# EAGLE design MINI_SAM_TQFP_1.27_SIMPLE_2016_12_12_001 (EAGLE 7.6.0)
DESIGNER: BENJAMIN SHOCKLEY; REV: A
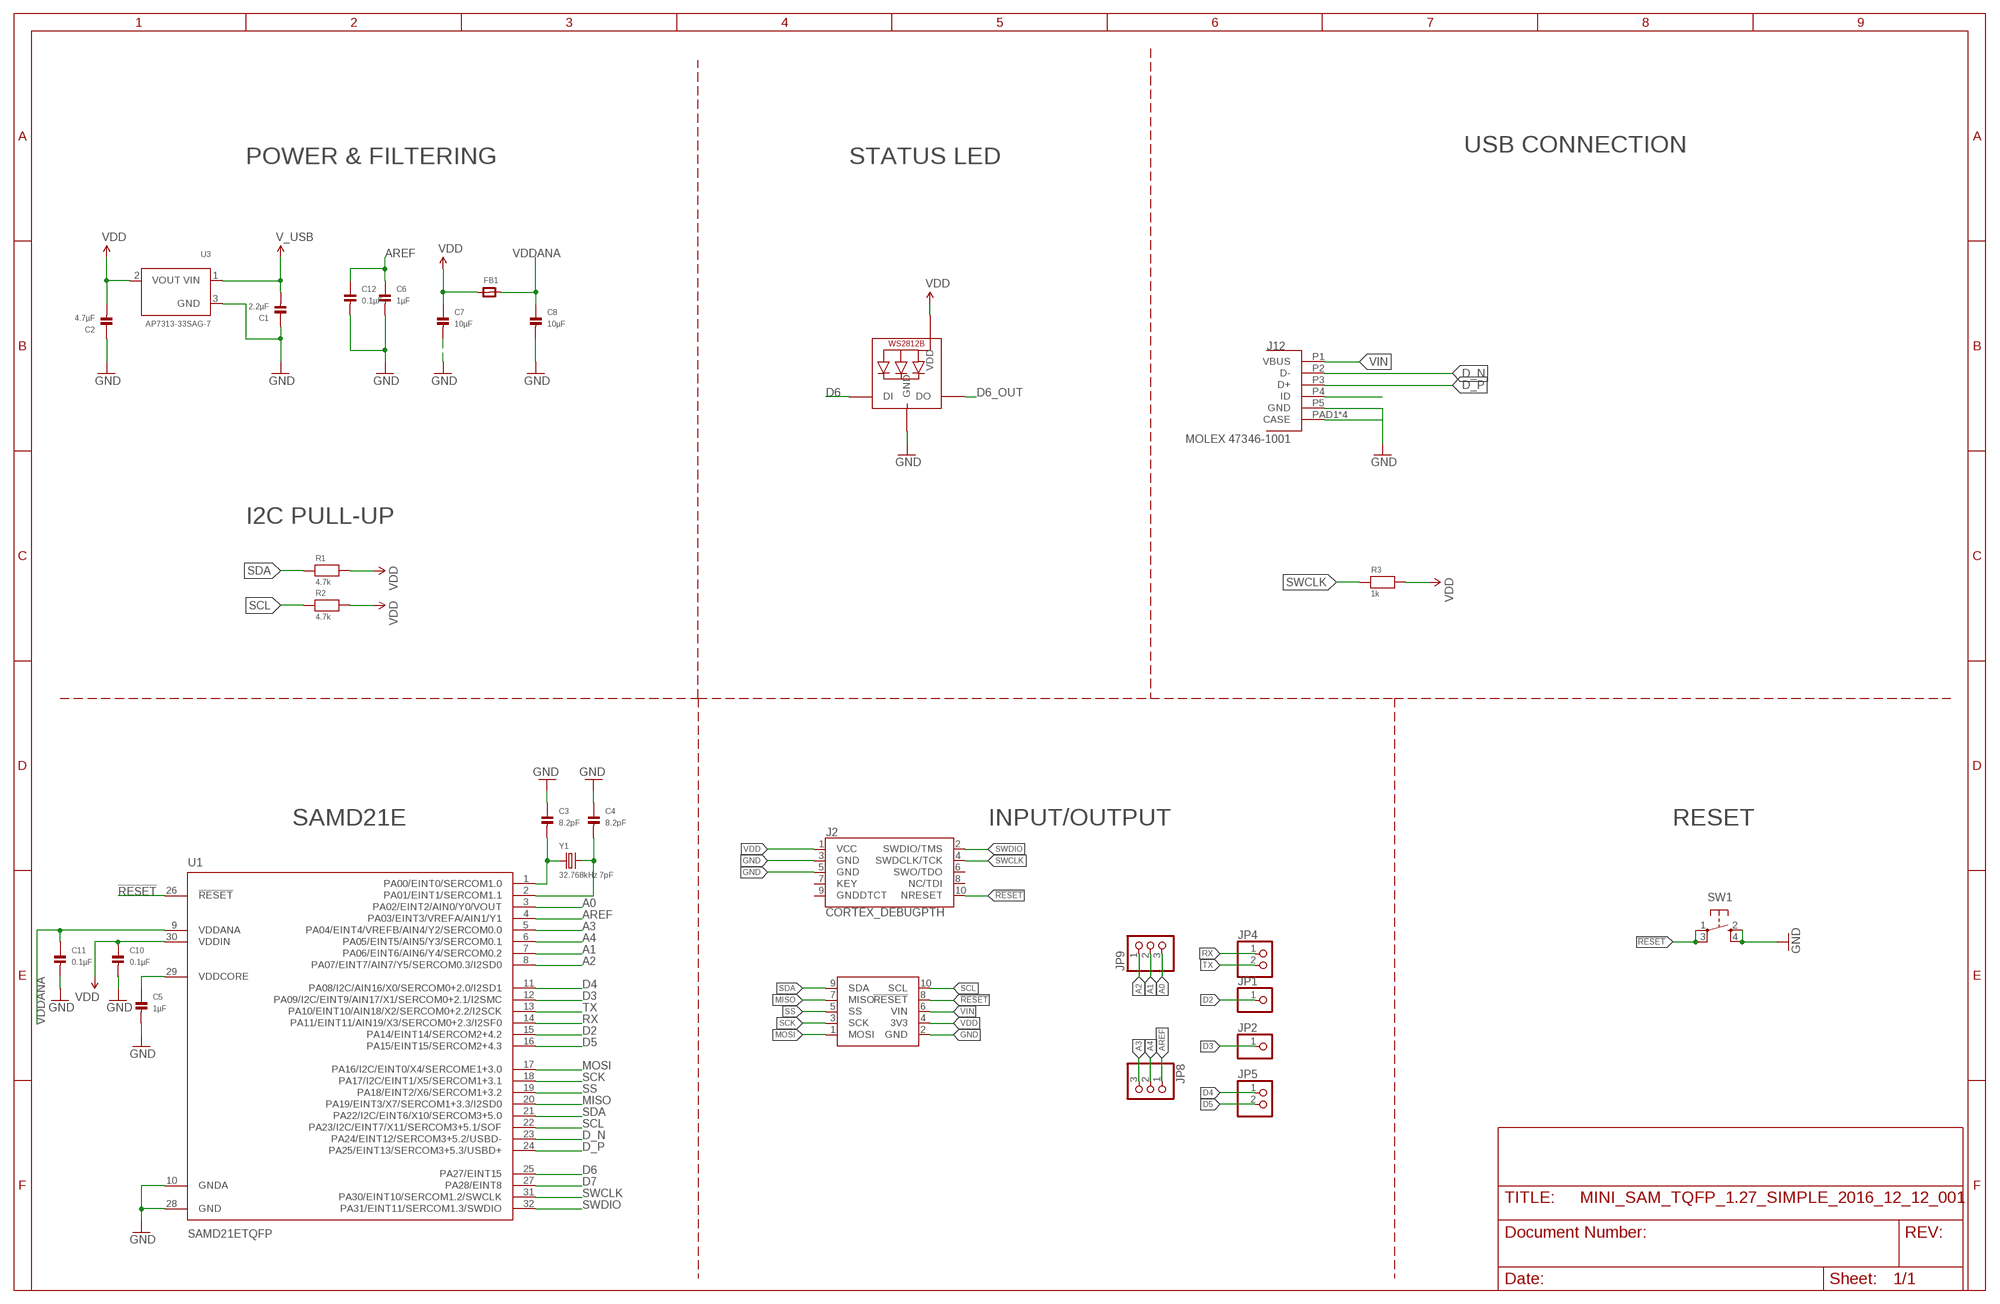
[diagram p0: schematic, sheet 1]

## Parts
C1  2.2µF  CAP_CERAMIC_0805MP  [_0805MP]
C2  4.7µF  CAP_CERAMIC_0805MP  [_0805MP]
C3  8.2pF  CAP_CERAMIC_0805MP  [_0805MP]
C4  8.2pF  CAP_CERAMIC_0805MP  [_0805MP]
C5  1µF  CAP_CERAMIC_0805MP  [_0805MP]
C6  1µF  CAP_CERAMIC_0805MP  [_0805MP]
C7  10µF  CAP_CERAMIC_0805MP  [_0805MP]
C8  10µF  CAP_CERAMIC_0805MP  [_0805MP]
C10  0.1µF  CAP_CERAMIC_0805MP  [_0805MP]
C11  0.1µF  CAP_CERAMIC_0805MP  [_0805MP]
C12  0.1µF  CAP_CERAMIC_0805MP  [_0805MP]
FB1  FERRITE_0805MP  [_0805MP]
J2  CORTEX_DEBUGPTH  [2X5-PTH-1.27MM]
J12  MOLEX_47346-100147346  [MOLEX_47346-1001]
JP1  HEADER-1X1ROUND  [1X01_ROUND]
JP2  HEADER-1X1ROUND  [1X01_ROUND]
JP4  HEADER-1X2ROUND  [1X02_ROUND]
JP5  HEADER-1X2ROUND  [1X02_ROUND]
JP8  HEADER-1X3ROUND  [1X03_ROUND]
JP9  HEADER-1X3ROUND  [1X03_ROUND]
R1  4.7k  RESISTOR_0805MP  [_0805MP]
R2  4.7k  RESISTOR_0805MP  [_0805MP]
R3  1k  RESISTOR_0805MP  [_0805MP]
STATUS  WS2812B3535  [LED3535]
SW1  SPST_TACT-KMR2  [KMR2]
U1  SAMD21ETQFP  [TQFP32-08]
U3  AP7313-33SAG-7  VREG_SOT23  [SOT23-R]
U$3  MINI_SAM_10_PIN  [M50-360XXXX]
Y1  32.768kHz 7pF  CRYSTAL0805PACKAGE  [_0805MP]

## Nets
!RESET: J2.10(NRESET) SW1.1(P) SW1.3(P1) U1.26(!RESET) U$3.8(!RESET)
A0: JP9.3 U1.3(PA02/EINT2/AIN0/Y0/VOUT)
A1: JP9.2 U1.7(PA06/EINT6/AIN6/Y4/SERCOM0.2)
A2: JP9.1 U1.8(PA07/EINT7/AIN7/Y5/SERCOM0.3/I2SD0)
A3: JP8.3 U1.5(PA04/EINT4/VREFB/AIN4/Y2/SERCOM0.0)
A4: JP8.2 U1.6(PA05/EINT5/AIN5/Y3/SERCOM0.1)
AREF: C6.1 C12.1 JP8.1 U1.4(PA03/EINT3/VREFA/AIN1/Y1)
D2: JP1.1 U1.15(PA14/EINT14/SERCOM2+4.2)
D3: JP2.1 U1.12(PA09/I2C/EINT9/AIN17/X1/SERCOM0+2.1/I2SMC)
D4: JP5.1 U1.11(PA08/I2C/AIN16/X0/SERCOM0+2.0/I2SD1)
D5: JP5.2 U1.16(PA15/EINT15/SERCOM2+4.3)
D6: STATUS.1(DI) U1.25(PA27/EINT15)
D6_OUT: STATUS.3(DO)
D7: U1.27(PA28/EINT8)
D_N [USB_DATA]: J12.P2(D-) U1.23(PA24/EINT12/SERCOM3+5.2/USBD-)
D_P [USB_DATA]: J12.P3(D+) U1.24(PA25/EINT13/SERCOM3+5.3/USBD+)
GND: C1.1 C2.1 C3.1 C4.1 C5.2 C6.2 C7.2 C8.2 C10.2 C11.2 C12.2 J2.3(GND) J2.5(GND) J12.P5(GND) J12.PAD1(CASE) J12.PAD2(CASE) J12.PAD3(CASE) J12.PAD4(CASE) STATUS.4(GND) SW1.2(S) SW1.4(S1) U1.10(GNDA) U1.28(GND) U3.3(GND) U$3.2(GND)
MISO: U1.20(PA19/EINT3/X7/SERCOM1+3.3/I2SD0) U$3.7(MISO)
MOSI: U1.17(PA16/I2C/EINT0/X4/SERCOME1+3.0) U$3.1(MOSI)
N$1: C3.2 U1.1(PA00/EINT0/SERCOM1.0) Y1.1
N$5: C4.2 U1.2(PA01/EINT1/SERCOM1.1) Y1.2
N$9: C5.1 U1.29(VDDCORE)
N$10: J12.P4(ID)
RX: JP4.1 U1.14(PA11/EINT11/AIN19/X3/SERCOM0+2.3/I2SF0)
SCK: U1.18(PA17/I2C/EINT1/X5/SERCOM1+3.1) U$3.3(SCK)
SCL: R2.1 U1.22(PA23/I2C/EINT7/X11/SERCOM3+5.1/SOF) U$3.10(SCL)
SDA: R1.1 U1.21(PA22/I2C/EINT6/X10/SERCOM3+5.0) U$3.9(SDA)
SS: U1.19(PA18/EINT2/X6/SERCOM1+3.2) U$3.5(SS)
SWCLK: J2.4(SWDCLK/TCK) R3.1 U1.31(PA30/EINT10/SERCOM1.2/SWCLK)
SWDIO: J2.2(SWDIO/TMS) U1.32(PA31/EINT11/SERCOM1.3/SWDIO)
TX: JP4.2 U1.13(PA10/EINT10/AIN18/X2/SERCOM0+2.2/I2SCK)
VDD: C2.2 C7.1 C10.1 FB1.1 J2.1(VCC) R1.2 R2.2 R3.2 STATUS.2(VDD) U1.30(VDDIN) U3.2(VOUT) U$3.4(3V3)
VDDANA: C8.1 C11.1 FB1.2 U1.9(VDDANA)
VIN: C1.2 J12.P1(VBUS) U3.1(VIN) U$3.6(VIN) ; supply symbol labelled V_USB
Unconnected: J2.6(SWO/TDO) J2.7(KEY) J2.8(NC/TDI) J2.9(GNDDTCT)

## Notes on the sheet
- USB CONNECTION
- POWER & FILTERING | STATUS LED
- MOLEX 47346-1001
- I2C PULL-UP
- SAMD21E | INPUT/OUTPUT | RESET

## Library data of the parts
C1-C8 C10-C12 = microbuilder:CAP_CERAMIC: Ceramic Capacitors 0402 - 0402 Surface Mount Capacitors 16pF 50V 5% [Digikey: 445-4899-2-ND] 18pF 50V 5% [Digikey: 490-1281-2-ND] 22pF 50V 5% [Digikey: 490-1283-2-ND] 68pF 50V 5% [Digikey: 490-1289-2-ND] 0.1uF 10V 10% [Digikey: 490-1318-2-ND] 1.0uF 6.3V 10% [Digikey: 490-1320-2-ND] 0603 - 0603 Surface Mount Capacitors 16 pF 50V 5% [Digikey: 445-5051-2-ND] 22 pF 50V [Digikey: PCC220ACVTR-ND] 33 pF 50V 5% [Digikey: 490-1415-1-ND] 56pF 50V 5% [Digikey: 490-1421-1-ND] 220pF 50V 5% [Digikey: 445-1285-1-ND] 680 pF 50V 2200 pF 50V 5% C0G [Digikey: 445-1297-1-ND] 5600 pF 100V 5% X7R [Digikey: 478-3711-1-ND] 0.1 µF 25V 10% [Digikey: PCC2277TR-ND] 0.22 µF 16V 10% X7R [Digikey: 445-1318-1-ND] 1.0 µF 25V 10% [Digikey: 445-5146-2-ND] 0603 - RF Specific 3pF 250V +/-0.1pF RF [Digikey: 712-1347-1-ND] 18 pF 250V 5% [Digikey: 478-3505-1-ND or 712-1322-1-ND] 56 pF 250V 5% C0G RF [Digikey: 490-4867-1-ND] 68 pF 250V RF [Digikey: 490-4868-1-ND] 0805 - 0805 Surface Mount Capacitors 220 pF 250V 2% RF Ceramic Capacitor [Digikey: 712-1398-1-ND] 1000 pF 50V 2% NP0 Ceramic Capacitor [Digikey: 478-3760-1-ND] 0.1 µF 25V 10% Ceramic Capacitor [Digikey: PCC1828TR-ND] 1.0 µF 16V 10% Ceramic Capacitor[Digikey: 490-1691-2-ND] 10.0 µF 10V 10% Ceramic Capacitor[Digikey: 709-1228-1-ND] 10.0 uF 16V 10% Ceramic Capacitor [Digikey: 478-5165-2-ND] 47 uF 6.3V 20% Ceramic Capacitor [Digikey: 587-1779-1-ND or 399-5506-1-ND] 1206 - 1206 Surface Mount Capacitors 47uF 10V 20% Ceramic Capacitor [Digikey: 490-5528-1-ND or 399-5508-1-ND or 445-6010-1-ND] 100uF 6.3V -20%, +80% Y5V Ceramic Capacitor (Digikey: 490-4512-1-ND, Mouser: 81-GRM31CF50J107ZE1L)
FB1 = microbuilder:FERRITE: Ferrite Bead 0603 MMZ1608B121C - 120 Ohm @ 100MHz, 600mA, 0.15 Ohm DC Resistance - Digikey: 445-2164-1-ND BK1608HW121-T - 120 Ohm, 600mA Ferrite Chip - Digikey: 587-1876-2-ND 0805 HZ0805B272R-10 - 2.7K Ohm @ 100MHz, 200mA, 0.8 Ohm DC Resistance - Digikey: 240-2504-1-ND (see also Murata BLM21BD272SN1L) MMZ2012Y152B - 1.5K Ohm @ 100MHz, 500mA, 0.4 Ohm DC Resistance - Digikey: 445-1560-1-ND - Mainly for high frequency (80-400MHz) MMZ2012R102A - 1K Ohm @ 100MHz, 500mA, 0.3 Ohm DC Resistance - Digikey: 445-1555-2-ND - More general purpose (10-200MHz)
J2 = SparkFun-Connectors:CORTEX_DEBUG: Cortex Debug Connector Datasheet <http://infocenter.arm.com/help/topic/com.arm.doc.faqs/attached/13634/cortex_debug_connectors.pdf>
J12 = Shockley_Custom:MOLEX_47346-1001
JP1 JP2 = microbuilder:HEADER-1X1: PIN HEADER
JP4 JP5 = microbuilder:HEADER-1X2: PIN HEADER
JP8 JP9 = microbuilder:HEADER-1X3: PIN HEADER
R1-R3 = microbuilder:RESISTOR: Resistors 0402 - 0402 Surface Mount Package 22 Ohm 1% 1/16W [Digikey: 311-22.0LRTR-ND] 33 Ohm 5% 1/16W 1.0K 5% 1/16W 1.5K 5% 1/16W 2.0K 1% 1/16W 10.0K 1% 1/16W [Digikey: 311-10.0KLRTR-ND] 10.0K 5% 1/16W [Digikey: RMCF0402JT10K0TR-ND] 12.1K 1% 1/16W [Digikey: 311-22.0LRTR-ND] 100.0K 5% 1/16W 0603 - 0603 Surface Mount Package 0 Ohm 1/10 Watt 1% Resistor 15 Ohm 1/10 Watt 1% Resistor 33 Ohm 1/10 Watt 1% Resistor 49.9 Ohm 1/10 Watt 1% Resistor 100 Ohm 1/10 Watt 1% Resistor 150 Ohm 1/10 Watt 1% Resistor 240 Ohm 1/10 Watt 1% Resistor 390 Ohm 1/10 Watt 1% Resistor 560 Ohm 1/10 Watt 1% Resistor 680 Ohm 1/10 Watt 1% Resistor 750 Ohm 1/10 Watt 1% Resistor 1.0K Ohm 1/10 Watt 1% Resistor 1.5K Ohm 1/10 Watt 1% Resistor 2.0K Ohm 1/10 Watt 1% Resistor 2.2K Ohm 1/10 Watt 1% Resistor 3.3K Ohm 1/10 Watt 1% Resistor 4.7K Ohm 1/10 Watt 1% Resistor 10.0K Ohm 1/10 Watt 1% Resistor 12.0K Ohm 1/10 Watt 1% Resistor 12.1K Ohm 1/10 Watt 1% Resistor 20.0K Ohm 1/10 Watt 1% Resistor 33.0K Ohm 1/10 Watt 1% Resistor 100.0K Ohm 1/10 Watt 1% Resistor 0805 - 0805 Surface Mount Package 0 Ohm 1/8 Watt 1% Resistor 33 Ohm 1/8 Watt 1% Resistor 100 Ohm 1/8 Watt 1% Resistor 150 Ohm 1/8 Watt 1% Resistor 200 Ohm 1/8 Watt 1% Resistor 240 Ohm 1/8 Watt 1% Resistor 330 Ohm 1/8 Watt 1% Resistor 390 Ohm 1/8 Watt 1% Resistor 470 Ohm 1/8 Watt 1% Resistor 1.0K Ohm 1/8 Watt 1% Resistor 1.5K Ohm 1/8 Watt 1% Resistor 2.0K Ohm 1/8 Watt 1% Resistor 4.7K Ohm 1/8 Watt 1% Resistor 5.1K Ohm 1/8 Watt 1% Resistor 5.6K Ohm 1/8 Watt 1% Resistor 10.0K Ohm 1/8 Watt 1% Resistor 22.0K Ohm 1/8 Watt 1% Resistor 33.0K Ohm 1/8 Watt 1% Resistor 100K Ohm 1/8 Watt 1% Resistor 1206 - 1206 Surface Mount Package 2012 - 2010 Surface Mount Package 0.11 Ohm 1/2 Watt 1% Resistor - Digikey: RHM.11UCT-ND
STATUS = adafruit:WS2812B
SW1 = adafruit:SPST_TACT: SMT 6mm switch, EVQQ2 series http://www.ladyada.net/library/eagle
U1 = Shockley_Custom:SAMD21E
U3 = microbuilder:VREG_SOT23: SOT23 Fixed Voltage Regulators Part Current Out V Out V In V Dropout Digikey Part No. AP7313 150mA 3.3V 3.5-6V 0.15V @ 150mA AP7313-33SAG-7DICT-ND
U$3 = Shockley_Custom:MINI_SAM_10_PIN
Y1 = Shockley_Custom:CRYSTAL: Crystals HC49UP - Surface Mount Crystal 4.0MHz 18pF +/-30ppm Surface Mount Crystal [Digikey: 535-9857-1-ND] 12.0 MHz Surface Mount Crystal [Digikey: 535-9869-6-ND] 25.0 MHz Surface Mount Crystal [Digikey: 535-9078-1-ND] 2.5 x 2.0mm - MEMs SMT Crystal 16.0 MHz 10pF 20ppm 2.5 x 2.0mm Crystal [Digikey -40-85°C: 535-10923-1-ND] 3.2 x 2.5mm - MEMs SMT Crystal 12.0 MHz 8pF 15ppm 3.2 x 2.5mm Crystal [Digikey: -10-70°C: 644-1047-1-ND -40-125°C: 644-1128-1-ND] 16.0 MHz 8pF 15ppm 3.2 x 2.5mm Crystal [Digikey: -10-70°C: 644-1049-1-ND -40-125°C: 644-1129-2-ND] 16.0 MHz 10pF 10ppm 3.2 x 2.5mm Crystal [Digikey: 644-1100-1-ND] 27.12 MHz 18pF 30ppm 3.2 x 2.5mm Crystal [Digikey: 887-1424-1-ND] 27.12MHz 10pF 10ppm 3.2 x 2.5mm Crystal [Digikey: 887-1329-1-ND] 4.9 x 1.8mm - MEMs SMT Crystal 32.768 KHz 12.5pF 20ppm 4.9 x 1.8mm Crystal [Digikey: SE2415CT-ND] 8.0 x 3.8mm - Surface Mount Crystal 32.768kHz 12.5pF 20ppm -40°C-85°C [Digikey: 535-9166-2-ND] Cylinder 32.768KHz Cylinder Crystal (2x6mm body) [Ex. Digikey: 300-8341-2-ND]

## Board
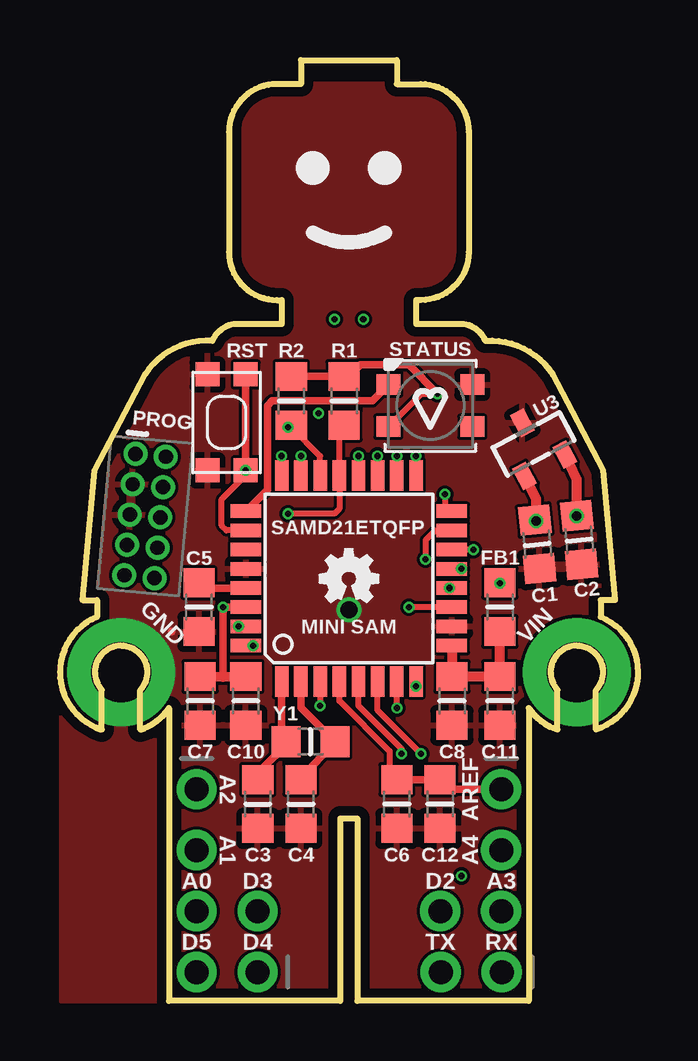
[diagram p1: board, top side]
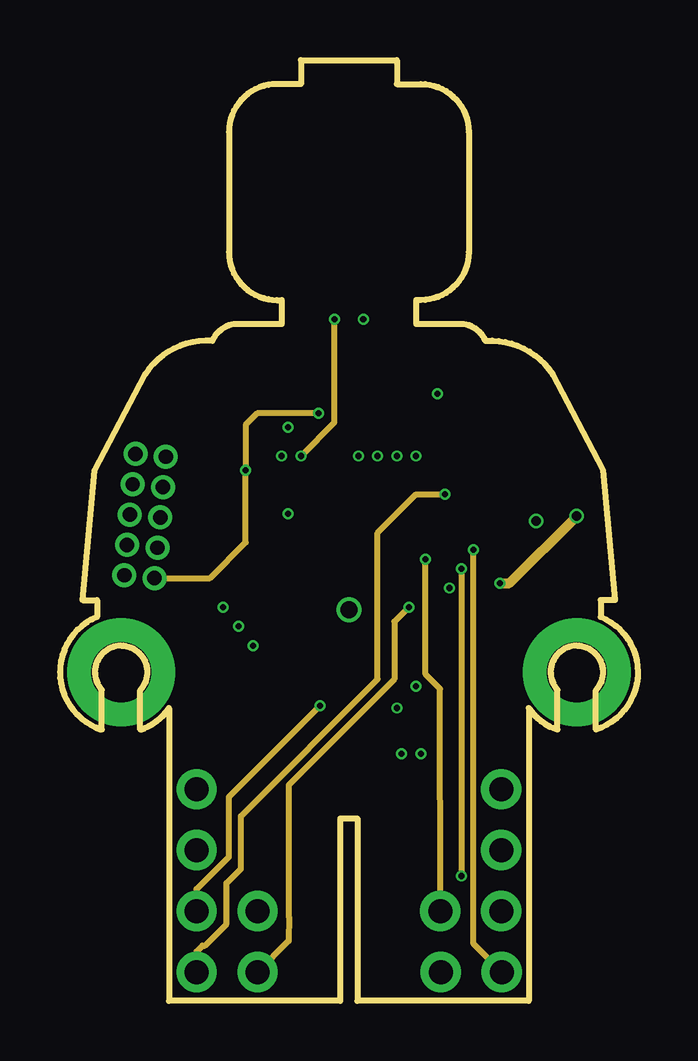
[diagram p2: board, inner layer Route2]
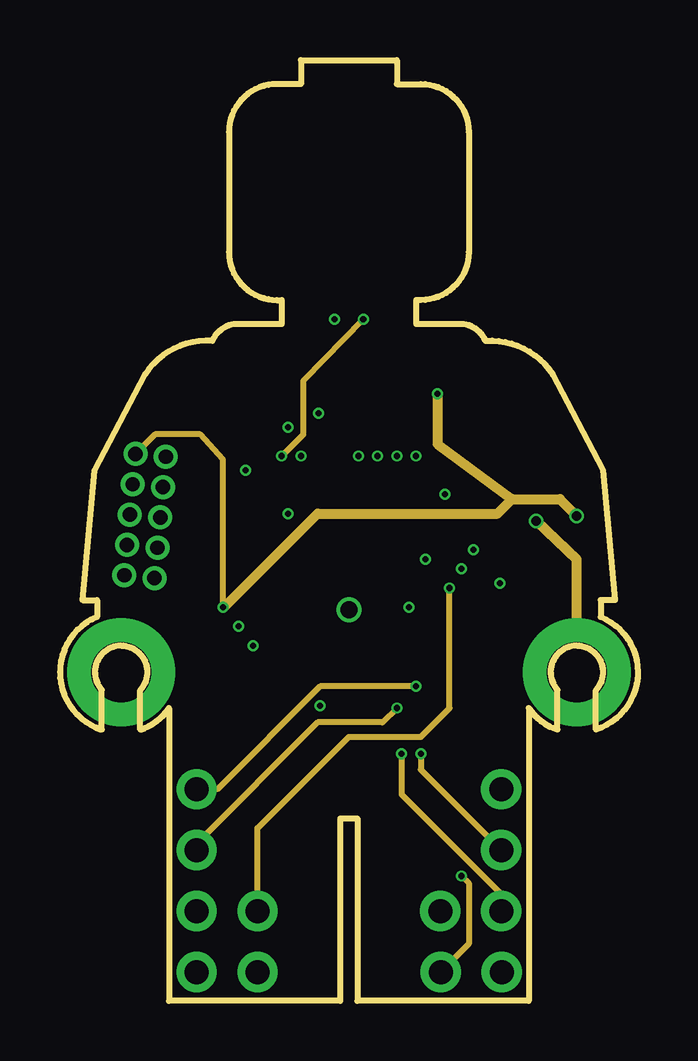
[diagram p3: board, inner layer Route15]
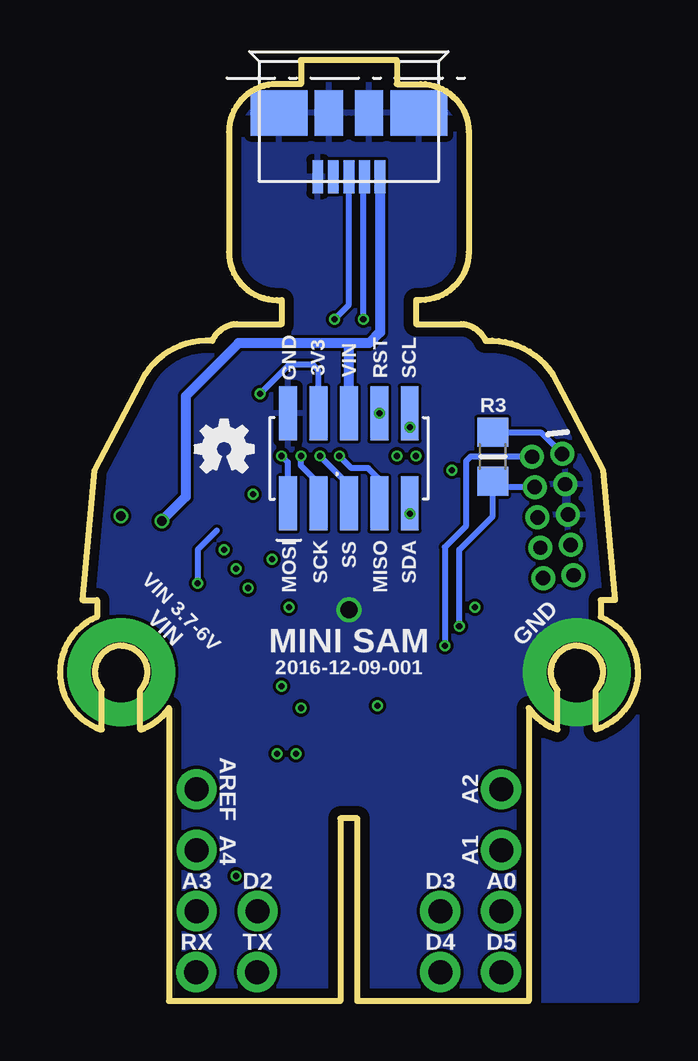
[diagram p4: board, bottom side, seen from below]

Size 24.1 x 39.2 mm. Coordinates in mm from the lower left corner, seen from the top.
Outline: 4.55,12.2 4.55,0 11.7,0 11.7,7.6 12.4,7.6 12.4,0 19.55,0 19.55,12.2
Outline: 4.55,12.2 arc-28 3.65,11.4
Outline: 4.55,12.2 arc-40 3.35,11.3 3.35,12.95 arc132 2.55,14.8 arc132 1.75,12.95 1.75,11.3 arc-140 1.55,16 1.55,16.7 0.95,16.7 1.45,22.1 3.55,26.1 arc-60 6.35,27.5 arc-63 7.37,28.2 9.25,28.2 9.25,29.2 9.05,29.2 arc-90 7.05,31.2 7.05,36.2 arc-90 9.05,38.2 10.05,38.2 10.05,39.2 14.05,39.2 14.05,38.2 15.05,38.2 arc-90 17.05,36.2 17.05,31.2 arc-90 15.05,29.2 14.85,29.2 14.85,28.2 16.73,28.2 arc-63 17.75,27.5 arc-60 20.55,26.1 22.65,22.1 23.15,16.7 22.55,16.7 22.55,16 arc-140 22.35,11.3 22.35,12.95 arc132 21.55,14.8 arc132 20.75,12.95 20.75,11.3 arc-40 19.55,12.2
Outline: 19.55,12.2 arc28 20.45,11.4
Copper layers (1*2*15*16): Top 0.035559375mm / dielectric 0.17018125mm / Route2 0.01778125mm / dielectric 47mil / Route15 0.01778125mm / dielectric 0.17018125mm / Bottom 0.035559375mm
Design rules "OSHPark-4layer *": minimum track width 5mil, minimum drill 10mil, track to track 5mil, track to pad 5mil, pad to pad 5mil, via to via 5mil, smd to smd 5mil, copper to edge 15mil, drill to drill 6mil, minimum pad ring 4mil, minimum via ring 4mil, stop-mask expansion 2.5mil, vias tented up to drill 28mil, thermal gap 10mil

### Footprints (pad centres in the part's own frame; a part is rotated, then mirrored left to right if it is on the bottom)
_0805MP = smd 1.2 x 1.3: 1 -1.016,0; 2 1.016,0
2X5-PTH-1.27MM = drill 0.6 pad 1: 1 -2.54,-0.635; 2 -2.54,0.635; 3 -1.27,-0.635; 4 -1.27,0.635; 5 0,-0.635; 6 0,0.635; 7 1.27,-0.635; 8 1.27,0.635; 9 2.54,-0.635; 10 2.54,0.635
MOLEX_47346-1001 = smd 0.45 x 1.38: P1 1.3,-2.66; P2 0.65,-2.66; P3 0,-2.66; P4 -0.65,-2.66; P5 -1.3,-2.66 | smd 2.375 x 1.9: PAD1 -2.913,0; PAD4 2.913,0 | smd 1.175 x 1.9: PAD2 -0.838,0; PAD3 0.838,0
1X01_ROUND = drill 1 pad 1.676: 1 0,0
1X02_ROUND = drill 1 pad 1.676: 1 -1.27,0; 2 1.27,0
1X03_ROUND = drill 1 pad 1.676: 1 -2.54,0; 2 0,0; 3 2.54,0
LED3535 = smd 1 x 0.85: 1 -1.75,0.875; 2 -1.75,-0.875; 3 1.75,-0.875; 4 1.75,0.875
KMR2 = smd 1 x 1: 1 2,0.8; 2 2,-0.8; 3 -2,0.8; 4 -2,-0.8
TQFP32-08 = smd 1.27 x 0.559: 1 -4.293,2.8; 2 -4.293,2; 3 -4.293,1.2; 4 -4.293,0.4; 5 -4.293,-0.4; 6 -4.293,-1.2; 7 -4.293,-2; 8 -4.293,-2.8; 17 4.293,-2.8; 18 4.293,-2; 19 4.293,-1.2; 20 4.293,-0.4; 21 4.293,0.4; 22 4.293,1.2; 23 4.293,2; 24 4.293,2.8 | smd 0.559 x 1.27: 9 -2.8,-4.293; 10 -2,-4.293; 11 -1.2,-4.293; 12 -0.4,-4.293; 13 0.4,-4.293; 14 1.2,-4.293; 15 2,-4.293; 16 2.8,-4.293; 25 2.8,4.293; 26 2,4.293; 27 1.2,4.293; 28 0.4,4.293; 29 -0.4,4.293; 30 -1.2,4.293; 31 -2,4.293; 32 -2.8,4.293
SOT23-R = smd 0.635 x 1.016: 1 -0.95,-1; 2 0.95,-1; 3 0,1
M50-360XXXX = smd 0.74 x 2.25: 1 -2.54,-1.875; 2 -2.54,1.875; 3 -1.27,-1.875; 4 -1.27,1.875; 5 0,-1.875; 6 0,1.875; 7 1.27,-1.875; 8 1.27,1.875; 9 2.54,-1.875; 10 2.54,1.875

### Placement (x,y rotation side)
C1  19.9,19.02 95.7 top
C2  21.65,19.2 95.7 top
C3  8.25,8.2 90 top
C4  10.05,8.2 90 top
C5  5.8,16.4 270 top
C6  14.05,8.2 270 top
C7  5.85,12.5 270 top
C8  16.35,12.5 270 top
C10  7.75,12.5 270 top
C11  18.35,12.5 270 top
C12  15.85,8.2 270 top
FB1  18.35,16.4 270 top
J2  3.55,20.2 264.7 top
J12  12.05,37 0 bottom
JP1  15.86,3.74 0 top
JP2  8.24,3.74 0 top
JP4  17.15,1.2 180 top
JP5  6.97,1.2 180 top
JP8  18.4,6.28 270 top
JP9  5.7,6.28 270 top
R1  11.85,25 90 top
R2  9.65,25 90 top
R3  6.05,22.67 90 bottom
STATUS  15.45,24.8 0 top
SW1  6.95,24.1 270 top
U1  12.05,17.6 90 top
U3  19.75,23.2 27.7 top
U$1  [OSHW-LOGO-MINI]  12.05,17.6 0 top
U$2  [OSHW-LOGO-MINI]  17.25,23 0 bottom
U$3  12.05,22.6 0 bottom
Y1  10.45,10.8 0 top

### Tracks (layer width: path | path; a pad name or v marks a point on that pad's centre or on a via)
!RESET  (via drill 0.25)
  Top 0.254: U1.26 6.95,19.6 6.75,19.8 6.75,20.9 7.75,21.9 SW1.1
  Top 0.305: SW1.1 SW1.3
  Route2 0.254: J2.10 6.26,17.61 7.75,19.1 SW1.1 7.75,24 8.22,24.48 U$3.8
  other vias: 7.75,22.1 10.78,24.48
A0  (via drill 0.25)
  Top 0.254: U1.3 v10.85,12.3
  Route2 0.254: JP9.3 5.7,4.65 7.05,6 7.05,8.5 v10.85,12.3
A1  (via drill 0.25)
  Top 0.254: v14.05,12.2 U1.7
  Route15 0.254: v14.05,12.2 13.45,11.6 10.75,11.6 5.7,6.55 JP9.2
A2  (via drill 0.25)
  Top 0.254: U1.8 v14.85,13.1
  Route15 0.254: v14.85,13.1 10.85,13.1 6.57,8.82 JP9.1
A3  (via drill 0.25)
  Top 0.254: v14.25,10.3 14.25,10.5 12.45,12.3 U1.5
  Route15 0.254: v14.25,10.3 14.25,8.6 18.4,4.45 JP8.3
A4  (via drill 0.25)
  Top 0.254: v15.05,10.3 13.25,12.1 U1.6
  Route15 0.254: v15.05,10.3 15.05,9.63 JP8.2
AREF
  Top 0.254: 15.74,8.82 C12.1 | U1.4 11.65,12.5 13.75,10.4 13.75,9.42 C6.1
  Top 0.305: C6.1 C12.1 | JP8.1 15.74,8.82
D2  (via drill 0.25)
  Top 0.254: U1.15 15.65,19.6 15.25,19.2 v15.25,18.4
  Route2 0.254: v15.25,18.4 15.25,13.6 15.85,13 JP1.1
D3  (via drill 0.25)
  Top 0.254: U1.12 v16.25,17.2
  Route15 0.254: JP2.1 8.24,7.19 12.05,11 15.05,11 16.25,12.2 v16.25,17.2
D4  (via drill 0.25)
  Top 0.254: U1.11 v14.55,16.4
  Route2 0.254: JP5.1 9.54,2.5 9.55,3.5 9.55,9 13.95,13.4 13.95,15.8 v14.55,16.4
D5  (via drill 0.25)
  Top 0.254: v16.05,21.1 16.05,20.4 U1.16
  Route2 0.254: JP5.2 5.7,2.05 5.95,2.3 6.05,2.3 6.95,3.2 6.95,4.9 7.55,5.5 7.55,7.7 13.25,13.4 13.25,19.5 14.85,21.1 v16.05,21.1
D6
  Top 0.305: U1.25 8.65,21.3 8.65,24.8 8.85,25 13.02,25 STATUS.1
D_N  (via drill 0.25)
  Top 0.254: U1.23 v10.05,22.7
  Route2 0.254: v10.05,22.7 11.45,24.1 v11.45,28.4
  Bottom 0.254: v11.45,28.4 11.45,34.29 J12.P2
D_P  (via drill 0.25)
  Top 0.254: U1.24 v9.25,22.7
  Route15 0.254: v12.65,28.4 10.17,25.85 10.15,25.83 10.15,23.6 v9.25,22.7
  Bottom 0.254: v12.65,28.4 12.05,29 J12.P3
GND  (via drill 0.7, 2.5 pad 4.5)
  Top 0.305: 4.65,15.4 4.66,15.38
  other vias: 2.55,13.7 12.05,16.3
  pour Top: 0.05,0 24.05,0 24.05,38.2 0.05,38.2
  pour Bottom: 0.05,0 24.05,0 24.05,38.2 0.05,38.2
MISO  (via drill 0.25)
  Top 0.254: U1.20 v12.45,22.7
  Bottom 0.254: U$3.7 10.85,20.8 10.85,21.8 11.25,22.2 11.95,22.2 v12.45,22.7
MOSI  (via drill 0.25)
  Top 0.254: U1.17 v14.85,22.7
  Bottom 0.254: U$3.1 14.59,22.44 v14.85,22.7
N$1
  Top 0.254: 9.55,10.78 Y1.1 9.25,11.08 | 8.35,9.58 C3.2
  Top 0.305: 9.55,10.78 8.35,9.58 | U1.1 9.25,11.08
N$5
  Top 0.254: 10.35,9.58 C4.2
  Top 0.305: 10.35,9.58 Y1.2 10.05,12.22 U1.2
N$9
  Top 0.254: 6.01,17.2 C5.1
  Top 0.305: U1.29 6.01,17.2
RX  (via drill 0.25)
  Top 0.254: v17.25,18.8 U1.14
  Route2 0.254: v17.25,18.8 17.25,2.37 JP4.1
SCK  (via drill 0.25)
  Top 0.254: U1.18 v14.05,22.7
  Bottom 0.254: U$3.3 13.45,20.86 13.45,21.7 14.05,22.3 v14.05,22.7
SCL  (via drill 0.25)
  Top 0.254: U1.22 10.85,22.7 9.65,23.9 R2.1 v9.51,23.9
  Bottom 0.254: U$3.10 v9.51,23.9
SDA  (via drill 0.25)
  Top 0.254: v9.51,20.3 11.45,20.3 11.65,20.5 U1.21 11.65,23.78 R1.1
  Bottom 0.254: U$3.9 v9.51,20.3
SS  (via drill 0.25)
  Top 0.254: U1.19 v13.25,22.7
  Bottom 0.254: U$3.5 12.25,20.93 12.25,21.7 v13.25,22.7
SWCLK  (via drill 0.25)
  Top 0.254: U1.31 v7.45,15.6
  Bottom 0.254: v7.45,15.6 7.45,18.8 6.05,20.2 R3.1 5.85,21.41 5.84,21.41 J2.4
SWDIO  (via drill 0.25)
  Top 0.203: U1.32 v8.05,14.8
  Bottom 0.254: v8.05,14.8 8.05,18.9 7.15,19.8 7.15,22.5 6.98,22.67 J2.2
TX  (via drill 0.25)
  Top 0.254: v16.75,18 U1.13
  Route2 0.254: v16.75,18 v16.75,5.2
  Route15 0.254: v16.75,5.2 17.05,4.9 17.05,2.37 JP4.2
VDD  (via drill 0.25, 0.4)
  Top 0.254: 7.83,13.7 C10.1 | v18.35,17.4 FB1.1 | v21.55,20.2 C2.2 | STATUS.2 15.05,25.27 v15.75,25.3
  Top 0.305: 6.8,13.5 v6.8,16.4 U1.30 | R2.2 R1.2 12.05,26.02 12.53,26.5 14.55,26.5 v15.75,25.3
  Top 0.406: C10.1 6.8,13.5 C7.1 | U3.2 21.55,21.7 C2.2
  Route2 0.406: v18.35,17.4 18.74,17.4 v21.55,20.2
  Route15 0.254: v6.8,16.4 6.8,22.55 5.85,23.6 3.96,23.6 J2.1
  Route15 0.406: v6.8,16.4 6.85,16.4 10.75,20.3 18.25,20.3 18.85,20.9 | 18.85,20.9 20.85,20.9 v21.55,20.2 | v15.75,25.3 15.75,23.2 18.85,20.9
  Bottom 0.254: R3.2 4.05,23.69 J2.1 | 17.55,19.6 18.35,18.8 v18.35,17.4 | U$3.4 13.32,26.27 13.55,26.5 14.55,26.5 v15.75,25.3
VDDANA
  Top 0.254: C8.1
  Top 0.406: C8.1 C11.1 FB1.2 | U1.9 C8.1
VIN  (via drill 0.4, 2.5 pad 4.5)
  Top 0.254: 19.85,20.08 C1.2 19.83,20 v19.85,20
  Top 0.305: U3.1 19.75,21.1
  Top 0.406: U3.1 19.85,20.9 19.85,20.08
  Route15 0.406: v21.55,13.7 21.55,18.38 v19.85,20
  Bottom 0.406: J12.P1 10.75,27.85 11.2,27.4 12.05,27.4 | 12.05,27.4 16.65,27.4 18.85,25.2 18.85,21 v19.85,20 | U$3.6 12.05,27.4

### Text on the board
tPlace: GND | VIN
tNames: RST | PROG | MINI SAM | A2 | AREF | A1 | A4 | A0 | D3 | D2 | A3 | D5 | D4 | TX | RX
bNames: SCL | RST | VIN | 3V3 | GND | SS | SDA | MISO | SCK | MOSI | GND | VIN 3.7-6V | VIN | 2016-12-09-001 | MINI SAM | A2 | AREF | A1 | A4 | A0 | D3 | D2 | A3 | D5 | D4 | TX | RX